# Altium project ife18_TS_AIL_Buck.PrjPcb
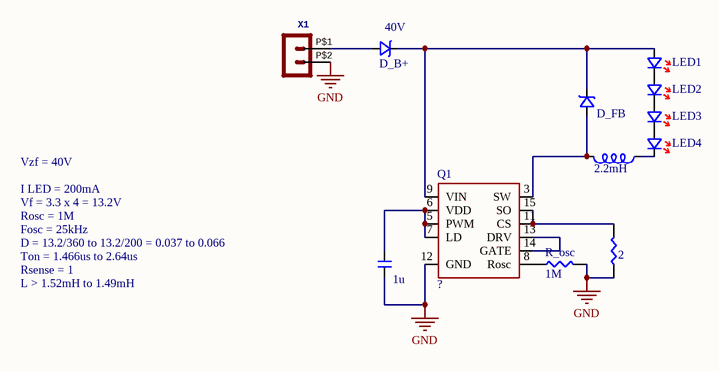
[diagram p0: ife18_TS_AIL_Buck.SchDoc]
1 sheet, 12 parts. Net scope: global (net labels, ports and power ports of the same name join across sheets).
Board file: ife18_TS_AIL_Buck.PcbDoc

## Sheet ife18_TS_AIL_Buck.SchDoc
size A

### Parts
C_VDD  1u  [CAP-0603]
D_B+  40V  [SMB]
D_FB  ?  [SMB]  (value not drawn)
IND  2.2mH  [IND-8080]
LED1  LED XQA Red  [LED_XQARED]  (value not drawn)
LED2  LED XQA Red  [LED_XQARED]  (value not drawn)
LED3  LED XQA Red  [LED_XQARED]  (value not drawn)
LED4  LED XQA Red  [LED_XQARED]  (value not drawn)
Q1  ?  [SO-16]
R_osc  1M  [RES-0603]
R_sense  2  [RES-0603]
X1  Molex - Micro-Fit 3.0 Series connector,  3.00mm (0.118") pitch header, 2 positions.  [43650-0224]  (value not drawn)

### Nets
GND: C_VDD.1 Q1.12(GND) R_osc.2 R_sense.1 X1.P$2
NetC_VDD_2: C_VDD.2 Q1.5(PWM) Q1.6(VDD) Q1.7(LD)
NetD_B+_A: D_B+.A X1.P$1
NetD_B+_K: D_B+.K D_FB.K LED1.A Q1.9(VIN)
NetD_FB_A: D_FB.A IND.2 Q1.3(SW)
NetIND_1: IND.1 LED4.K
NetLED1_K: LED1.K LED2.A
NetLED2_K: LED2.K LED3.A
NetLED3_K: LED3.K LED4.A
NetQ1_8: Q1.8(Rosc) R_osc.1
NetQ1_11: Q1.11(CS) Q1.15(SO) R_sense.2
NetQ1_13: Q1.13(DRV) Q1.14(GATE)

### Notes on the sheet
- I LED = 200mA
- Vf = 3.3 x 4 = 13.2V
- Vzf = 40V
- D = 13.2/360 to 13.2/200 = 0.037 to 0.066
- Ton = 1.466us to 2.64us
- Fosc = 25kHz
- Rsense = 1
- Rosc = 1M
- L > 1.52mH to 1.49mH

### Library data of the parts
C_VDD = CAP-0603
D_B+ D_FB = DIODE-SMB
IND = IND-8080
LED1-LED4 = LED_XQARED
Q1 = IC-SO16_AL9901_1
R_osc R_sense = RES-0603
X1 = POS2_MF43650-0224: GateName_1: G$1; SymbolName_1: HEADER_POS2; DeviceSetName: HEADER_POS2_?; DeviceName: 43650-0224; LibraryName: MOLEX Micro-Fit; Package: 43650-0224